# EAGLE design breakout (EAGLE 6.1)
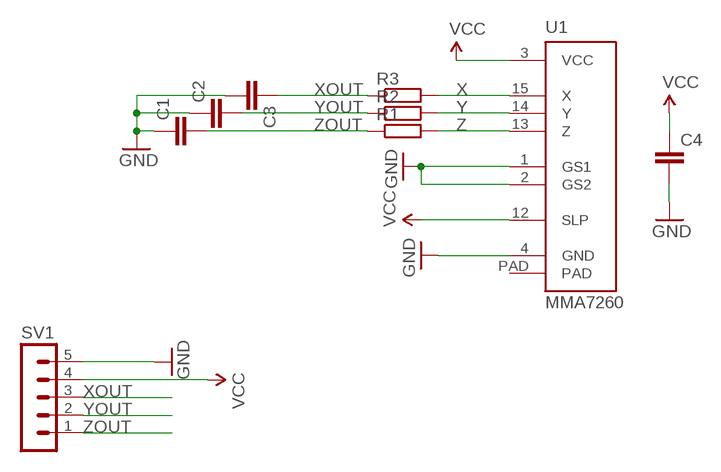
[diagram p0: schematic, sheet 1]

## Parts
C1  C-EUC1206  [C1206]
C2  C-EUC1206  [C1206]
C3  C-EUC1206  [C1206]
C4  C-EUC1206  [C1206]
R1  R-EU_R1206  [R1206]
R2  R-EU_R1206  [R1206]
R3  R-EU_R1206  [R1206]
SV1  MA05-1  [MA05-1]
U1  MMA7260  [MMA7260]

## Nets
GND: C1.1 C2.1 C3.2 C4.2 SV1.5 U1.1(GS1) U1.2(GS2) U1.4(GND)
VCC: C4.1 SV1.4 U1.3(VCC) U1.12(SLP)
X: R3.2 U1.15(X)
XOUT: C3.1 R3.1 SV1.3
Y: R2.2 U1.14(Y)
YOUT: C2.2 R2.1 SV1.2
Z: R1.2 U1.13(Z)
ZOUT: C1.2 R1.1 SV1.1
Unconnected: U1.PAD

## Library data of the parts
C1-C4 = rcl:C-EU: CAPACITOR, European symbol
R1-R3 = resistor:R-EU_: RESISTOR, European symbol
SV1 = con-lstb:MA05-1: PIN HEADER; OC_FARNELL: unknown; OC_NEWARK: unknown
U1 = SparkFun:MMA7260: MMA7260Q Triple axis accelerometer from Freescale. Schematic element and footprint production proven. Center pad has reduced paste layer for solder short reduction. Spark Fun Electronics SKU : COM-00308

## Board
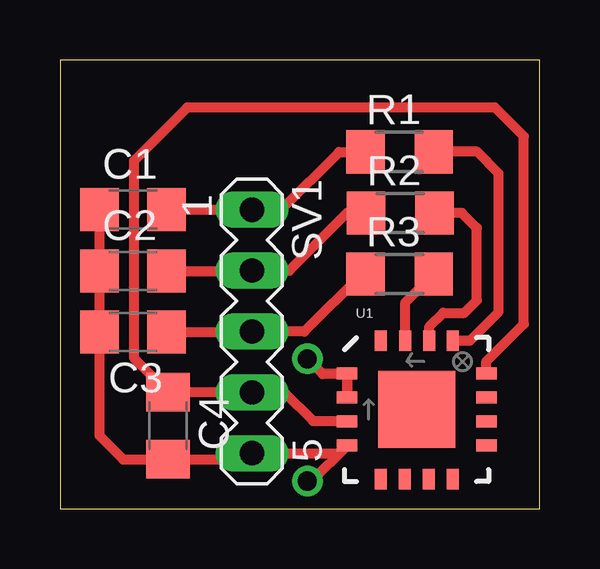
[diagram p1: board, top side]
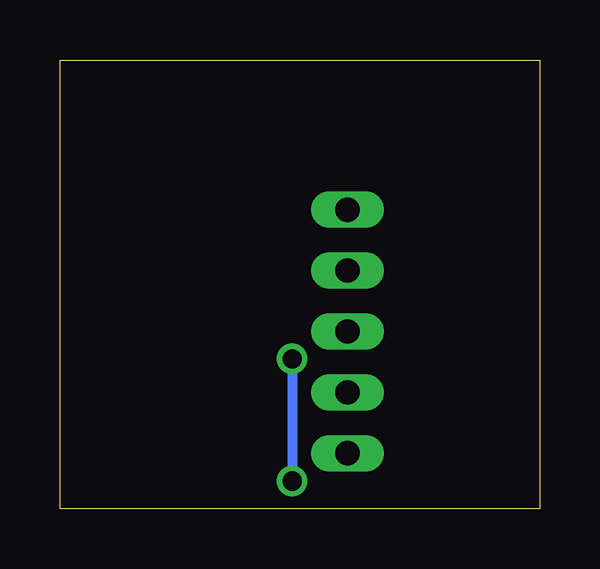
[diagram p2: board, bottom side, seen from below]

Size 19.98 x 18.72 mm. Coordinates in mm from the lower left corner, seen from the top.
Outline: 0,0 19.98,0 19.98,18.72 0,18.72 0,0
Copper layers (1*16): Top 0.035mm / dielectric 1.5mm / Bottom 0.035mm
Design rules: minimum track width 10mil, minimum drill 24mil, track to track 8mil, track to pad 8mil, pad to pad 8mil, via to via 8mil, smd to smd 8mil, copper to edge 40mil, drill to drill 8mil, minimum pad ring 10mil, minimum via ring 8mil, stop-mask expansion 4mil, vias tented up to drill 0mil, thermal gap 10mil

### Footprints (pad centres in the part's own frame; a part is rotated, then mirrored left to right if it is on the bottom)
C1206 = smd 1.6 x 1.8: 1 -1.4,0; 2 1.4,0
R1206 = smd 1.6 x 1.803: 1 -1.422,0; 2 1.422,0
MA05-1 = drill 1.016 long: 1 -5.08,0; 2 -2.54,0; 3 0,0; 4 2.54,0; 5 5.08,0
MMA7260 = smd 0.855 x 0.5: 1 -2.902,1.5; 2 -2.902,0.5; 3 -2.902,-0.5; 4 -2.902,-1.5; 9 2.902,-1.5; 10 2.902,-0.5; 11 2.902,0.5; 12 2.902,1.5 | smd 0.5 x 0.855: 5 -1.5,-2.902; 6 -0.5,-2.902; 7 0.5,-2.902; 8 1.5,-2.902; 13 1.5,2.877; 14 0.525,2.877; 15 -0.475,2.877; 16 -1.5,2.877 | smd 3.2 x 3.2: PAD 0,0

### Placement (x,y rotation side)
C1  3.04,12.48 0 top
C2  3.04,9.92 0 top
C3  3.04,7.38 180 top
C4  4.5,3.47 270 top
R1  14.15,14.89 0 top
R2  14.18,12.34 0 top
R3  14.15,9.79 0 top
SV1  8,7.4 270 top
U1  14.86,4.14 0 top

### Tracks (layer width: path | path; a pad name or v marks a point on that pad's centre or on a via)
GND  (via drill 0.8 pad 1.27)
  Top 0.406: C1.1 C2.1 C3.2 1.64,3.06 2.63,2.06 C4.2 7.75,2.07 SV1.5 11.63,2.32 U1.4 11.96,2.62 | U1.1 U1.2 11.96,5.61 11.98,5.62 10.94,5.62 v10.31,6.25 | v10.31,1.16 10.5,1.16 11.96,2.62 | 11.96,2.62 11.98,2.64
  Bottom 0.406: v10.31,6.25 v10.31,1.16
VCC
  Top 0.406: U1.3 11.95,3.66 10.54,3.66 9.35,4.86 SV1.4 7.98,4.87 C4.1 3.07,6.3 3.07,14.51 5.3,16.74 18.13,16.74 19.32,15.54 19.32,7.71 17.77,6.15 U1.12
X
  Top 0.406: U1.15 14.39,8.61 R3.2
XOUT
  Top 0.406: R3.1 12.58,9.79 10.19,7.4 SV1.3 7.98,7.38 C3.1
Y
  Top 0.406: U1.14 15.39,7.6 15.96,8.17 16.85,8.17 17.37,8.7 17.37,11.71 16.75,12.34 R2.2
YOUT
  Top 0.406: R2.1 11.96,12.34 9.56,9.94 SV1.2 7.98,9.92 C2.2
Z
  Top 0.406: U1.13 17.09,7.02 18.28,8.21 18.28,13.99 17.38,14.89 R1.2
ZOUT
  Top 0.406: R1.1 11.63,14.88 9.22,12.48 SV1.1 C1.2